# EAGLE design BLDC (EAGLE 9.0.1)
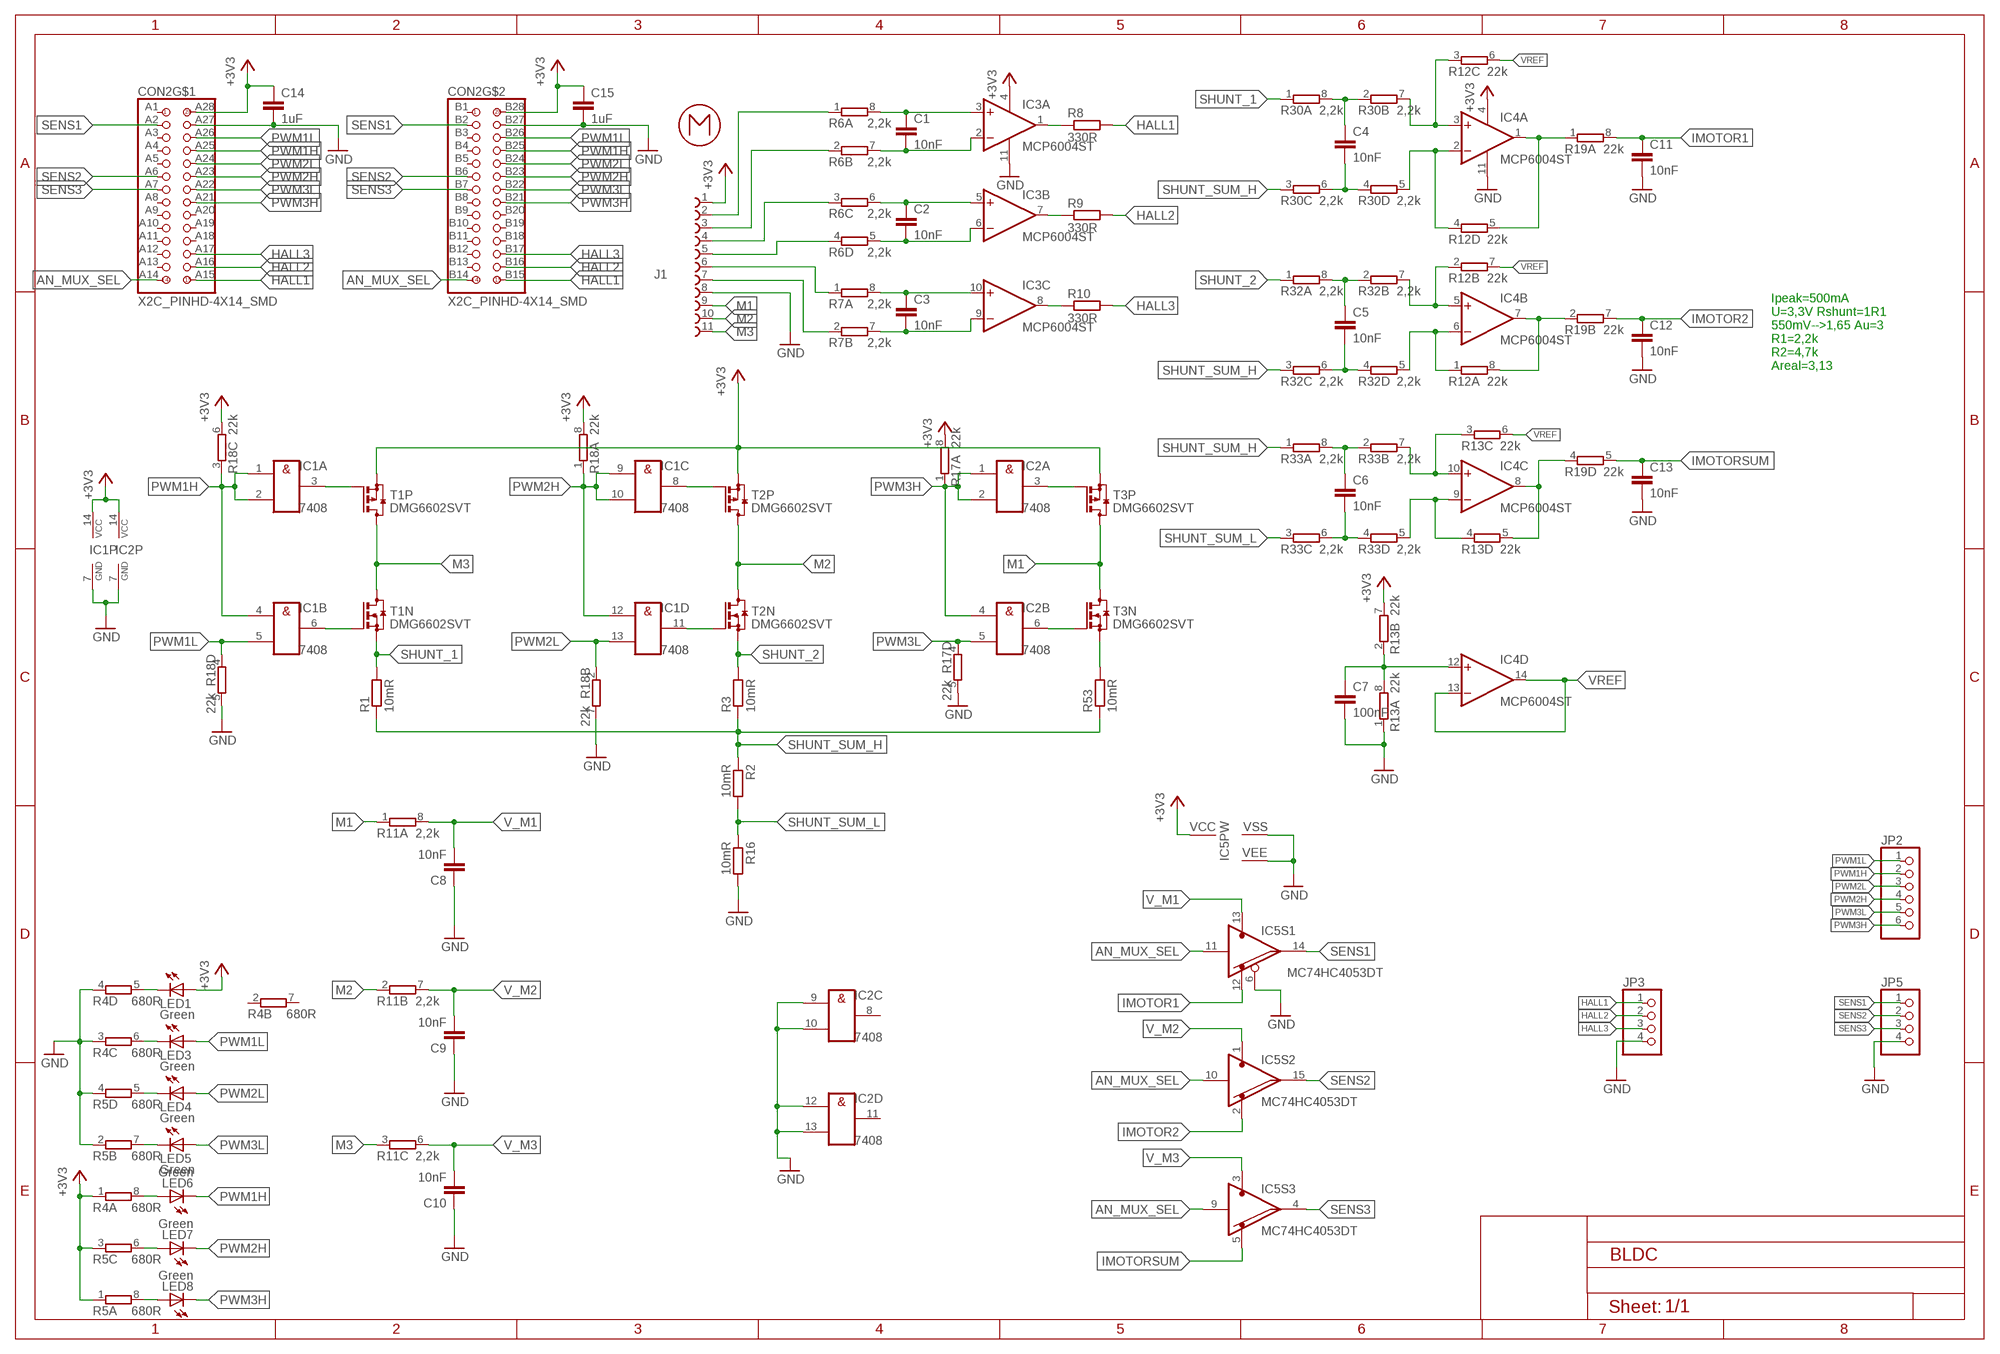
[diagram p0: schematic, sheet 1]

## Parts
C1  10nF  C-EU-SMD_0603_10NF  [C0603K]
C2  10nF  C-EU-SMD_0603_10NF  [C0603K]
C3  10nF  C-EU-SMD_0603_10NF  [C0603K]
C4  10nF  C-EU-SMD_0603_10NF  [C0603K]
C5  10nF  C-EU-SMD_0603_10NF  [C0603K]
C6  10nF  C-EU-SMD_0603_10NF  [C0603K]
C7  100nF  C-EU-SMD_0603_100NF_50V  [C0603K]
C8  10nF  C-EU-SMD_0603_10NF  [C0603K]
C9  10nF  C-EU-SMD_0603_10NF  [C0603K]
C10  10nF  C-EU-SMD_0603_10NF  [C0603K]
C11  10nF  C-EU-SMD_0603_10NF  [C0603K]
C12  10nF  C-EU-SMD_0603_10NF  [C0603K]
C13  10nF  C-EU-SMD_0603_10NF  [C0603K]
C14  1uF  C-EU-SMD_0603_1UF_10V  [C0603K]
C15  1uF  C-EU-SMD_0603_1UF_10V  [C0603K]
CON2  X2C_PINHD-4X14_SMD  [X2C_4X14_SMD]
IC1  7408  [TSSOP14]
IC2  7408  [TSSOP14]
IC3  MCP6004ST  [TSSOP14]
IC4  MCP6004ST  [TSSOP14]
IC5  MC74HC4053DT  [TSSOP16]
J1  68611114122  [68611114122]
JP2  PINHD-1X6  [1X06]
JP3  PINHD-1X4  [1X04]
JP5  PINHD-1X4  [1X04]
LED1  Green  LEDCHIPLED_0805_GREEN  [CHIPLED_0805]
LED3  Green  LEDCHIPLED_0805_GREEN  [CHIPLED_0805]
LED4  Green  LEDCHIPLED_0805_GREEN  [CHIPLED_0805]
LED5  Green  LEDCHIPLED_0805_GREEN  [CHIPLED_0805]
LED6  Green  LEDCHIPLED_0805_GREEN  [CHIPLED_0805]
LED7  Green  LEDCHIPLED_0805_GREEN  [CHIPLED_0805]
LED8  Green  LEDCHIPLED_0805_GREEN  [CHIPLED_0805]
R1  10mR  R-EU_SMDR1206_0,01R  [R1206]
R2  10mR  R-EU_SMDR1206_0,01R  [R1206]
R3  10mR  R-EU_SMDR1206_0,01R  [R1206]
R4  680R  4R-N680R  [EXBV8V_A]
R5  680R  4R-N680R  [EXBV8V_A]
R6  2,2k  4R-N2,2K  [EXBV8V_A]
R7  2,2k  4R-N2,2K  [EXBV8V_A]
R8  330R  R-EU_SMDR0603_330R  [R0603]
R9  330R  R-EU_SMDR0603_330R  [R0603]
R10  330R  R-EU_SMDR0603_330R  [R0603]
R11  2,2k  4R-N2,2K  [EXBV8V_A]
R12  22k  4R-N22K  [EXBV8V_A]
R13  22k  4R-N22K  [EXBV8V_A]
R16  10mR  R-EU_SMDR1206_0,01R  [R1206]
R17  22k  4R-N22K  [EXBV8V_A]
R18  22k  4R-N22K  [EXBV8V_A]
R19  22k  4R-N22K  [EXBV8V_A]
R30  2,2k  4R-N2,2K  [EXBV8V_A]
R32  2,2k  4R-N2,2K  [EXBV8V_A]
R33  2,2k  4R-N2,2K  [EXBV8V_A]
R53  10mR  R-EU_SMDR1206_0,01R  [R1206]
T1  DMG6602SVT  [TSOT23-6]
T2  DMG6602SVT  [TSOT23-6]
T3  DMG6602SVT  [TSOT23-6]
U$2  BLDC_MOTOR  [BLDC_MOTOR]

## Nets
+3V3: C14.1 C15.1 CON2.A28 CON2.B28(A28) IC1.14(P:VCC) IC2.14(P:VCC) IC3.4(P:V+) IC4.4(P:V+) IC5.16(PW:VCC) J1.1 LED1.A R4.1 R5.1 R5.3 R13.7 R17.8 R18.6 R18.8 T1.2(P:S) T2.2(P:S) T3.2(P:S)
AN_MUX_SEL: CON2.A14 CON2.B14(A14) IC5.9(S3:I) IC5.10(S2:I) IC5.11(S1:I)
GND: C7.2 C8.1 C9.1 C10.1 C11.2 C12.2 C13.2 C14.2 C15.2 CON2.A27 CON2.B27(A27) IC1.7(P:GND) IC2.7(P:GND) IC2.9(C:I0) IC2.10(C:I1) IC2.12(D:I0) IC2.13(D:I1) IC3.11(P:V-) IC4.11(P:V-) IC5.6 IC5.7(PW:VEE) IC5.8(PW:GND) J1.8 JP3.4 JP5.4 R4.3 R4.4 R5.2 R5.4 R13.1 R16.2 R17.5 R18.5 R18.7
HALL1: CON2.A15 CON2.B15(A15) JP3.1 R8.2
HALL2: CON2.A16 CON2.B16(A16) JP3.2 R9.2
HALL3: CON2.A17 CON2.B17(A17) JP3.3 R10.2
IMOTOR1: C11.1 IC5.12(S1:O2) R19.8
IMOTOR2: C12.1 IC5.2(S2:O2) R19.7
IMOTORSUM: C13.1 IC5.5(S3:O2) R19.5
M1: J1.9 R11.1 T3.4(P:D) T3.6(N:D)
M2: J1.10 R11.2 T2.4(P:D) T2.6(N:D)
M3: J1.11 R11.3 T1.4(P:D) T1.6(N:D)
N$1: IC1.3(A:O) T1.3(P:G)
N$2: IC1.6(B:O) T1.1(N:G)
N$3: IC1.8(C:O) T2.3(P:G)
N$4: IC1.11(D:O) T2.1(N:G)
N$5: IC2.3(A:O) T3.3(P:G)
N$6: IC2.6(B:O) T3.1(N:G)
N$7: C1.1 IC3.3(A:+IN) R6.8
N$8: C1.2 IC3.2(A:-IN) R6.7
N$9: IC4.8(C:OUT) R13.5 R19.4
N$10: C5.1 R32.2 R32.8
N$11: C4.1 R30.2 R30.8
N$12: C4.2 R30.4 R30.6
N$13: IC4.3(A:+IN) R12.3 R30.7
N$14: IC4.2(A:-IN) R12.4 R30.5
N$15: C5.2 R32.4 R32.6
N$16: IC4.6(B:-IN) R12.1 R32.5
N$17: IC4.5(B:+IN) R12.2 R32.7
N$18: C7.1 IC4.12(D:+IN) R13.2 R13.8
N$19: IC3.8(C:OUT) R10.1
N$20: LED8.A R5.8
N$21: C6.1 R33.2 R33.8
N$22: IC4.10(C:+IN) R13.3 R33.7
N$23: IC4.9(C:-IN) R13.4 R33.5
N$24: C6.2 R33.4 R33.6
N$25: LED7.A R5.6
N$26: LED5.C R5.7
N$27: IC4.7(B:OUT) R12.8 R19.2
N$28: C2.1 IC3.5(B:+IN) R6.6
N$29: LED4.C R5.5
N$30: LED6.A R4.8
N$31: LED3.C R4.6
N$32: LED1.C R4.5
N$33: IC4.1(A:OUT) R12.5 R19.1
N$35: C2.2 IC3.6(B:-IN) R6.5
N$36: C3.2 IC3.9(C:-IN) R7.7
N$39: R53.2 T3.5(N:S)
N$40: C3.1 IC3.10(C:+IN) R7.8
N$41: J1.2 R6.1
N$42: J1.3 R6.2
N$43: J1.4 R6.3
N$44: J1.5 R6.4
N$45: J1.6 R7.1
N$46: J1.7 R7.2
N$47: IC3.1(A:OUT) R8.1
N$48: IC3.7(B:OUT) R9.1
PWM1H: CON2.A25 CON2.B25(A25) IC1.1(A:I0) IC1.2(A:I1) IC1.4(B:I0) JP2.2 LED6.C R18.3
PWM1L: CON2.A26 CON2.B26(A26) IC1.5(B:I1) JP2.1 LED3.A R18.4
PWM2H: CON2.A23 CON2.B23(A23) IC1.9(C:I0) IC1.10(C:I1) IC1.12(D:I0) JP2.4 LED7.C R18.1
PWM2L: CON2.A24 CON2.B24(A24) IC1.13(D:I1) JP2.3 LED4.A R18.2
PWM3H: CON2.A21 CON2.B21(A21) IC2.1(A:I0) IC2.2(A:I1) IC2.4(B:I0) JP2.6 LED8.C R17.1
PWM3L: CON2.A22 CON2.B22(A22) IC2.5(B:I1) JP2.5 LED5.A R17.4
SENS1: CON2.A2 CON2.B2(A2) IC5.14(S1:O) JP5.1
SENS2: CON2.A6 CON2.B6(A6) IC5.15(S2:O) JP5.2
SENS3: CON2.A7 CON2.B7(A7) IC5.4(S3:O) JP5.3
SHUNT_1: R1.2 R30.1 T1.5(N:S)
SHUNT_2: R3.2 R32.1 T2.5(N:S)
SHUNT_SUM_H: R1.1 R2.1 R3.1 R30.3 R32.3 R33.1 R53.1
SHUNT_SUM_L: R2.2 R16.1 R33.3
V_M1: C8.2 IC5.13(S1:O1) R11.8
V_M2: C9.2 IC5.1(S2:O1) R11.7
V_M3: C10.2 IC5.3(S3:O1) R11.6
VREF: IC4.13(D:-IN) IC4.14(D:OUT) R12.6 R12.7 R13.6
Unconnected: CON2.A1 CON2.A3 CON2.A4 CON2.A5 CON2.A8 CON2.A9 CON2.A10 CON2.A11 CON2.A12 CON2.A13 CON2.A18 CON2.A19 CON2.A20 CON2.B1(A1) CON2.B3(A3) CON2.B4(A4) CON2.B5(A5) CON2.B8(A8) CON2.B9(A9) CON2.B10(A10) CON2.B11(A11) CON2.B12(A12) CON2.B13(A13) CON2.B18(A18) CON2.B19(A19) CON2.B20(A20) IC2.8(C:O) IC2.11(D:O) IC3.12(D:+IN) IC3.13(D:-IN) IC3.14(D:OUT) R4.2 R4.7 R7.3 R7.4 R7.5 R7.6 R11.4 R11.5 R17.2 R17.3 R17.6 R17.7 R19.3 R19.6

## Notes on the sheet
- Ipeak=500mA
  U=3,3V Rshunt=1R1
  550mV-->1,65 Au=3
  R1=2,2k
  R2=4,7k
  Areal=3,13

## Library data of the parts
C1-C6 C8-C13 = C_EU_Kando:C-EU-SMD: CAPACITOR, European symbol
C7 = C_EU_Kando:C-EU-SMD: CAPACITOR, European symbol; EAGLEID: 1204
C14 C15 = C_EU_Kando:C-EU-SMD: CAPACITOR, European symbol; EAGLEID: 1309
CON2 = KANDO_KOZOS:X2C_PINHD-4X14_SMD
IC1 IC2 = KANDO_KOZOS:7408: Quad 2-input AND gate
IC3 IC4 = KANDO_KOZOS:MCP6004: Quad Op Amp 2.7V to 6.0V Single Supply Source: http://www.microchip.com/wwwproducts/en/MCP6004
IC5 = MCHP_Egyeb_Kando:MC74HC4053: Triple single-pole, Double-position plus common off Analog multiplexer/demultiplexer
J1 = Wurth_Elektronik_Electromechanic_FPC_Connectors_&_Flat_Flexible_Cable_rev16a:68611114122: WR-FPC 1.00mm SMT ZIF Horizontal Top Contact, 11 Pins=>Code : Con_FPC_ZIF_1.00_68611114122 <http://katalog.we-online.de/media/images/eican/Con_FPC_ZIF_1.00_6861xx14122_pf2.jpg> Details see: http://katalog.we-online.de/en/em/686_1xx_141_22 Created 2014-07-09, Karrer Zheng 2014 (C) Würth Elektronik
JP2 = pinhead:PINHD-1X6: PIN HEADER
JP3 JP5 = KANDO_KOZOS:PINHD-1X4: PIN HEADER
LED1 LED3-LED8 = KANDO_KOZOS:LED: LED OSRAM: - CHIPLED LG R971, LG N971, LY N971, LG Q971, LY Q971, LO R971, LY R971 LH N974, LH R974 LS Q976, LO Q976, LY Q976 LO Q996 - Hyper CHIPLED LW Q18S LB Q993, LB Q99A, LB R99A - SideLED LS A670, LO A670, LY A670, LG A670, LP A670 LB A673, LV A673, LT A673, LW A673 LH A674 LY A675 LS A676, LA A676, LO A676, LY A676, LW A676 LS A679, LY A679, LG A679 - Hyper Micro SIDELED® LS Y876, LA Y876, LO Y876, LY Y876 LT Y87S - SmartLED LW L88C, LW L88S LB L89C, LB L89S, LG L890 LS L89K, LO L89K, LY L89K LS L896, LA L896, LO L896, LY L896 - TOPLED LS T670, LO T670, LY T670, LG T670, LP T670 LSG T670, LSP T670, LSY T670, LOP T670, LYG T670 LG T671, LOG T671, LSG T671 LB T673, LV T673, LT T673, LW T673 LH T674 LS T676, LA T676, LO T676, LY T676, LB T676, LH T676, LSB T676, LW T676 LB T67C, LV T67C, LT T67C, LS T67K, LO T67K, LY T67K, LW E67C LS E67B, LA E67B, LO E67B, LY E67B, LB E67C, LV E67C, LT E67C LW T67C LS T679, LY T679, LG T679 LS T770, LO T770, LY T770, LG T770, LP T770 LB T773, LV T773, LT T773, LW T773 LH T774 LS E675, LA E675, LY E675, LS T675 LS T776, LA T776, LO T776, LY T776, LB T776 LHGB T686 LT T68C, LB T68C - Hyper Mini TOPLED® LB M676 - Mini TOPLED Santana® LG M470 LS M47K, LO M47K, LY M47K Source: http://www.osram.convergy.de LUXEON: - LUMILED® LXK2-PW12-R00, LXK2-PW12-S00, LXK2-PW14-U00, LXK2-PW14-V00 LXK2-PM12-R00, LXK2-PM12-S00, LXK2-PM14-U00 LXK2-PE12-Q00, LXK2-PE12-R00, LXK2-PE12-S00, LXK2-PE14-T00, LXK2-PE14-U00 LXK2-PB12-K00, LXK2-PB12-L00, LXK2-PB12-M00, LXK2-PB14-N00, LXK2-PB14-P00, LXK2-PB14-Q00 LXK2-PR12-L00, LXK2-PR12-M00, LXK2-PR14-Q00, LXK2-PR14-R00 LXK2-PD12-Q00, LXK2-PD12-R00, LXK2-PD12-S00 LXK2-PH12-R00, LXK2-PH12-S00 LXK2-PL12-P00, LXK2-PL12-Q00, LXK2-PL12-R00 Source: www.luxeon.com KINGBRIGHT: KA-3528ASYC Source: www.kingbright.com; EAGLEID: 1109
R1-R3 R16 R53 = R_EU:R-EU_SMD: RESISTOR, European symbol
R4 R5 = KANDO_KOZOS:4R-N: Array Chip Resistor; EAGLEID: 1028
R6 R7 R11 R30 R32 R33 = KANDO_KOZOS:4R-N: Array Chip Resistor; EAGLEID: 1022
R8-R10 = R_EU:R-EU_SMD: RESISTOR, European symbol; EAGLEID: 1374
R12 R13 R17-R19 = R_EU:4R-N: Array Chip Resistor
T1-T3 = KANDO_KOZOS:DMG6602SVT; EAGLEID: 1334
U$2 = Gyore:BLDC_MOTOR

## Board
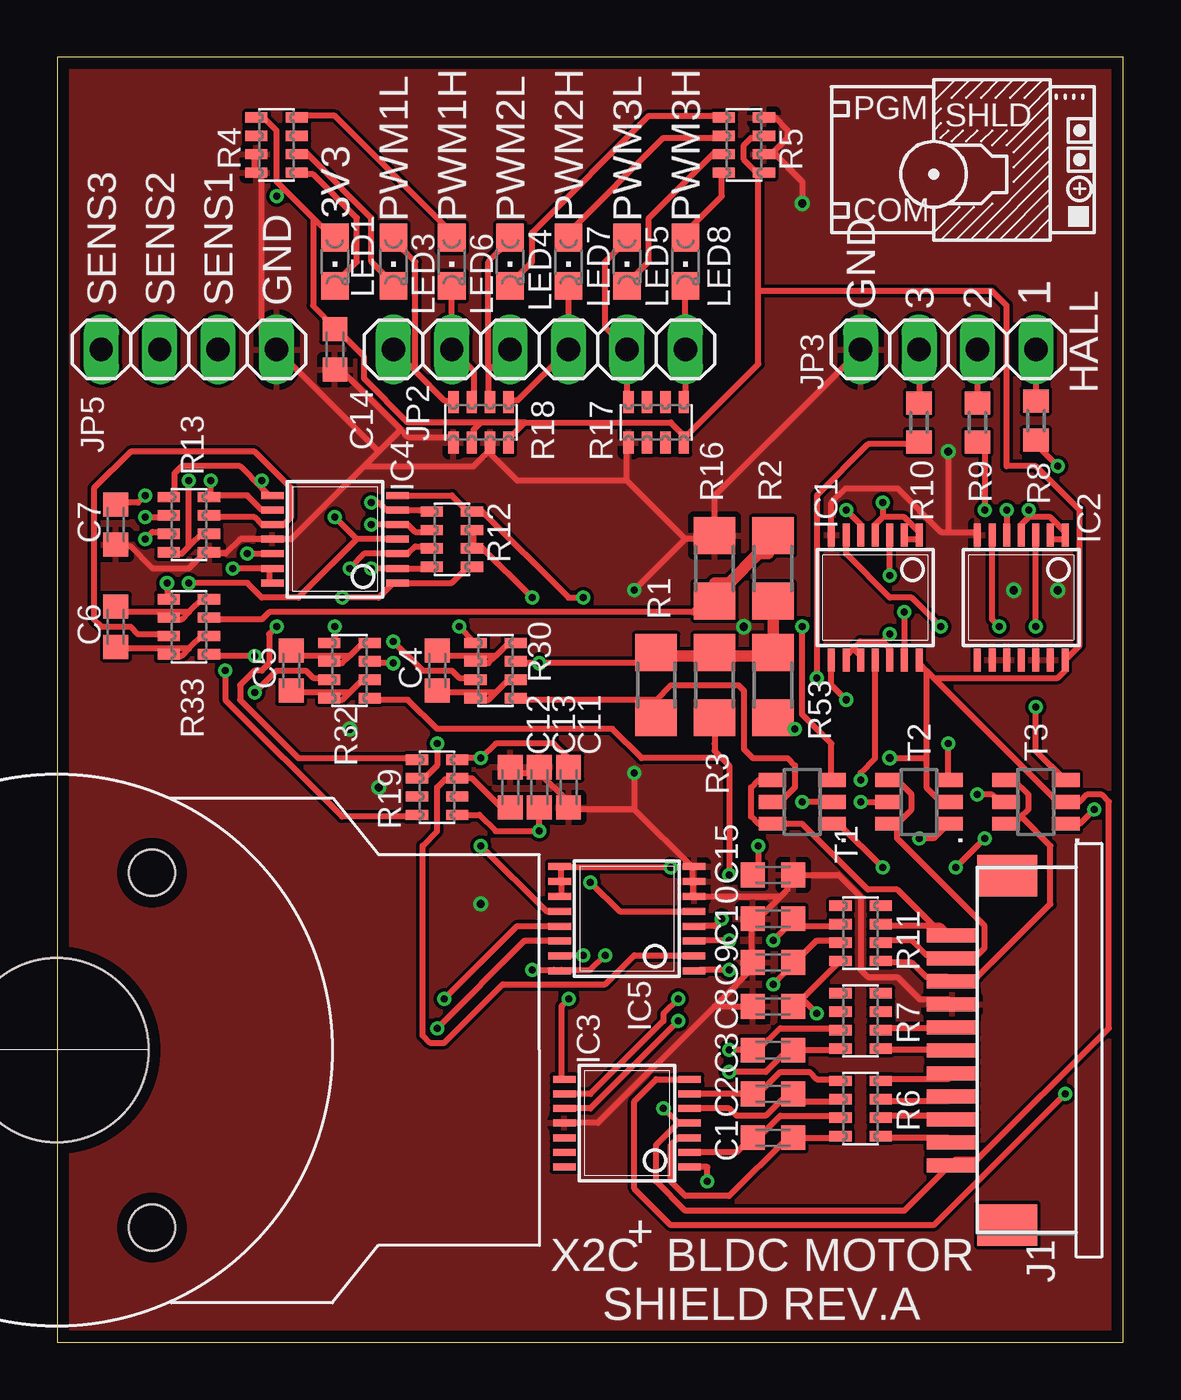
[diagram p1: board, top side]
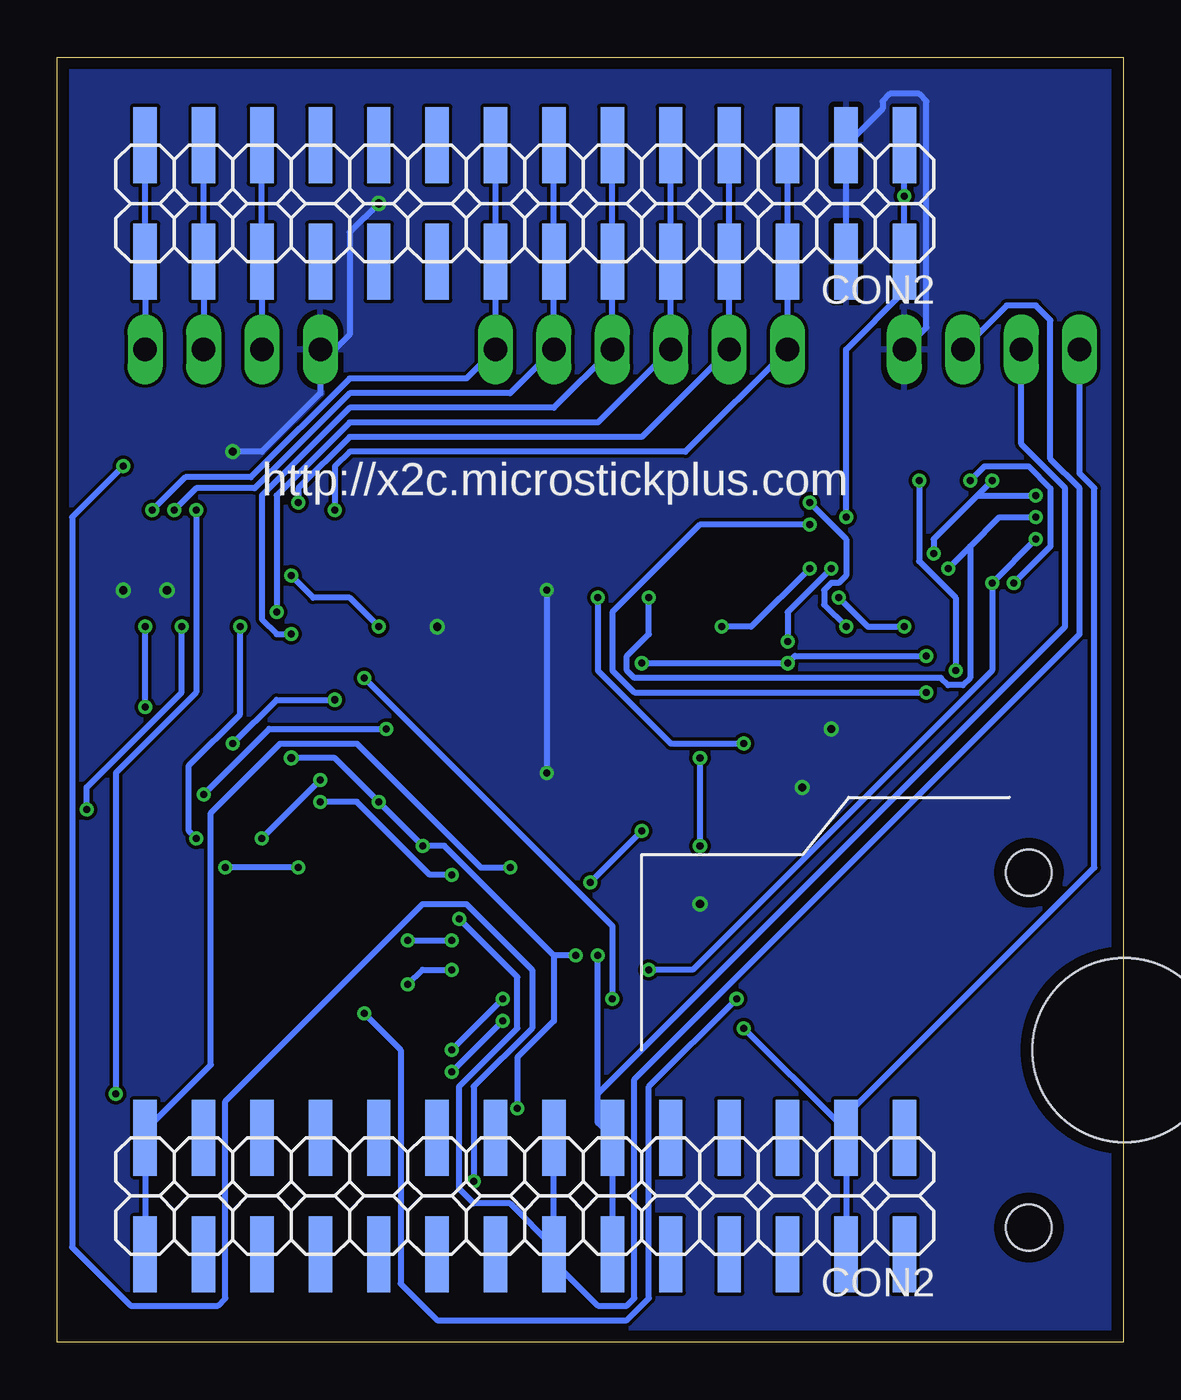
[diagram p2: board, bottom side, seen from below]

Size 46.35 x 55.88 mm. Coordinates in mm from the lower left corner, seen from the top.
Outline: 46.35,55.88 0,55.88 0,0 46.35,0 46.35,55.88
Copper layers (1*16): Top 0.035mm / dielectric 1.6mm / Bottom 0.035mm
Design rules "Elecrow_2-layer_PCB_eagle_rule *": minimum track width 10mil, minimum drill 12mil, track to track 6mil, track to pad 6mil, pad to pad 6mil, via to via 8mil, smd to smd 0mil, copper to edge 20mil, drill to drill 10mil, minimum pad ring 6mil, minimum via ring 6mil, stop-mask expansion 0mil, vias tented up to drill 100mil, thermal gap 10mil

### Footprints (pad centres in the part's own frame; a part is rotated, then mirrored left to right if it is on the bottom)
C0603K = smd 1.05 x 1.08: 1 -0.875,0; 2 0.875,0
X2C_4X14_SMD = smd 1.016 x 3.302: A1 -16.51,44.45; A2 -13.97,44.45; A3 -11.43,44.45; A4 -8.89,44.45; A5 -6.35,44.45; A6 -3.81,44.45; A7 -1.27,44.45; A8 1.27,44.45; A9 3.81,44.45; A10 6.35,44.45; A11 8.89,44.45; A12 11.43,44.45; A13 13.97,44.45; A14 16.51,44.45; A15 16.51,1.27; A16 13.97,1.27; A17 11.43,1.27; A18 8.89,1.27; A19 6.35,1.27; A20 3.81,1.27; A21 1.27,1.27; A22 -1.27,1.27; A23 -3.81,1.27; A24 -6.35,1.27; A25 -8.89,1.27; A26 -11.43,1.27; A27 -13.97,1.27; A28 -16.51,1.27; B1 -16.51,39.37; B2 -13.97,39.37; B3 -11.43,39.37; B4 -8.89,39.37; B5 -6.35,39.37; B6 -3.81,39.37; B7 -1.27,39.37; B8 1.27,39.37; B9 3.81,39.37; B10 6.35,39.37; B11 8.89,39.37; B12 11.43,39.37; B13 13.97,39.37; B14 16.51,39.37; B15 16.51,-3.81; B16 13.97,-3.81; B17 11.43,-3.81; B18 8.89,-3.81; B19 6.35,-3.81; B20 3.81,-3.81; B21 1.27,-3.81; B22 -1.27,-3.81; B23 -3.81,-3.81; B24 -6.35,-3.81; B25 -8.89,-3.81; B26 -11.43,-3.81; B27 -13.97,-3.81; B28 -16.51,-3.81
TSSOP14 = smd 0.305 x 0.991: 1 -1.905,-2.718; 2 -1.27,-2.718; 3 -0.635,-2.718; 4 0,-2.718; 5 0.635,-2.718; 6 1.27,-2.718; 7 1.905,-2.718; 8 1.905,2.718; 9 1.27,2.718; 10 0.635,2.718; 11 0,2.718; 12 -0.635,2.718; 13 -1.27,2.718; 14 -1.905,2.718
TSSOP16 = smd 0.305 x 0.991: 1 -2.275,-2.918; 2 -1.625,-2.918; 3 -0.975,-2.918; 4 -0.325,-2.918; 5 0.325,-2.918; 6 0.975,-2.918; 7 1.625,-2.918; 8 2.275,-2.918; 9 2.275,2.918; 10 1.625,2.918; 11 0.975,2.918; 12 0.325,2.918; 13 -0.325,2.918; 14 -0.975,2.918; 15 -1.625,2.918; 16 -2.275,2.918
68611114122 = smd 0.6 x 2.2: 1 -8.5,1.1; 2 -7.5,1.1; 3 -6.5,1.1; 4 -5.5,1.1; 5 -4.5,1.1; 6 -3.5,1.1; 7 -2.5,1.1; 8 -1.5,1.1; 9 -0.5,1.1; 10 0.5,1.1; 11 1.5,1.1 | smd 1.8 x 2.6: Z1 -11.1,-1.3; Z2 4.1,-1.3
1X06 = drill 1.016 long: 1 -6.35,0; 2 -3.81,0; 3 -1.27,0; 4 1.27,0; 5 3.81,0; 6 6.35,0
1X04 = drill 1.016 long: 1 -3.81,0; 2 -1.27,0; 3 1.27,0; 4 3.81,0
CHIPLED_0805 = smd 1.2 x 1.2: A 0,-1.05; C 0,1.05
R1206 = smd 1.6 x 1.803: 1 -1.422,0; 2 1.422,0
EXBV8V_A = smd 0.45 x 0.965: 1 -1.2,-0.876; 2 -0.4,-0.876; 3 0.4,-0.876; 4 1.2,-0.876; 5 1.2,0.876; 6 0.4,0.876; 7 -0.4,0.876; 8 -1.2,0.876
R0603 = smd 1 x 1.1: 1 -0.85,0; 2 0.85,0
TSOT23-6 = smd 0.6 x 1.2: 1 -0.95,-1.3; 2 0,-1.3; 3 0.95,-1.3; 4 0.95,1.3; 5 0,1.3; 6 -0.95,1.3
BLDC_MOTOR = hole 8: 0,-21 | hole 2: 0,-30.24; 7.72,-16.84; -7.72,-16.84

### Placement (x,y rotation side)
C1  31.11,8.89 180 top
C2  31.11,10.79 180 top
C3  31.11,12.7 180 top
C4  16.51,29.21 90 top
C5  10.16,29.21 90 top
C6  2.54,31.11 90 top
C7  2.54,35.56 270 top
C8  31.11,14.61 0 top
C9  31.11,16.51 0 top
C10  31.11,18.41 0 top
C11  22.23,24.13 270 top
C12  19.68,24.13 90 top
C13  20.95,24.13 90 top
C14  12.07,43.18 270 top
C15  31.11,20.32 0 top
CON2  26.04,48.26 180 bottom
IC1  35.56,32.38 180 top
IC2  41.91,32.38 180 top
IC3  24.77,9.53 90 top
IC4  12.06,34.92 90 top
IC5  24.77,18.41 90 top
J1  40.01,16.19 90 top
JP2  20.95,43.18 0 top
JP3  38.73,43.18 180 top
JP5  5.71,43.18 0 top
LED1  12.06,46.99 180 top
LED3  14.61,46.99 180 top
LED4  19.68,46.99 180 top
LED5  24.77,46.99 180 top
LED6  17.14,46.99 180 top
LED7  22.23,46.99 180 top
LED8  27.3,46.99 180 top
R1  26.04,28.57 270 top
R2  31.11,33.66 90 top
R3  28.57,28.57 270 top
R4  9.53,52.07 270 top
R5  29.84,52.07 90 top
R6  34.92,10.16 90 top
R7  34.92,13.97 90 top
R8  42.55,40.08 90 top
R9  40.01,40.01 90 top
R10  37.47,40.01 90 top
R11  34.92,17.78 90 top
R12  17.14,34.92 270 top
R13  5.71,35.56 90 top
R16  28.57,33.66 90 top
R17  26.04,40.01 180 top
R18  18.41,40.01 180 top
R19  16.51,24.13 270 top
R30  19.05,29.21 90 top
R32  12.7,29.21 90 top
R33  5.71,31.11 90 top
R53  31.11,28.57 270 top
T1  32.38,23.5 90 top
T2  37.47,23.5 90 top
T3  42.55,23.5 90 top
U$2  20.95,12.7 270 top

### Tracks (layer width: path | path; a pad name or v marks a point on that pad's centre or on a via)
+3V3  (via drill 0.3, 0.35)
  Top 0.254: 38.1,28.89 43.5,28.89 43.81,29.21 IC2.14 44.45,30.3 44.45,36.2 42.55,38.1 41.27,38.1 41.27,45.09 40.64,45.72 30.48,45.72 | 37.78,29.21 37.47,29.53 IC1.14 | 37.78,29.21 38.1,28.89 | 38.1,28.89 43.5,23.5 T3.2 44.45,23.5 44.77,23.81 45.4,23.81 45.72,23.5 45.72,13.65 40.01,7.94 39.05,7.94 J1.1 38.73,7.62 36.83,5.71 27.3,5.71 26.04,6.99 26.04,8.57 26.99,9.53 | T2.2 38.42,23.5 37.78,24.13 37.78,25.4 | 37.78,29.21 37.78,25.4 | 26.99,9.53 IC3.4 | 11.11,48.9 12.06,47.94 LED1.A | 11.11,48.9 9.84,50.16 | 9.84,50.16 9.53,50.48 9.53,52.7 8.89,53.34 R4.1 | 11.11,48.9 11.11,45.09 12.06,44.13 C14.1 12.38,43.81 13.34,42.86 13.34,41.91 15.24,40.01 18.41,40.01 | 9.84,50.16 v9.53,49.85 | 30.48,50.8 29.84,51.44 29.84,52.07 30.16,52.39 30.48,52.39 R5.3 | 27.3,39.37 26.67,40.01 20.32,40.01 | 20.32,40.01 19.68,39.37 R18.8 | 18.41,40.01 18.1,39.69 18.1,39.37 R18.6 | 20.32,40.01 18.41,40.01 | 30.48,45.72 30.48,42.55 27.3,39.37 | 30.48,45.72 30.48,50.8 | 30.48,50.8 R5.1 | 27.3,39.37 R17.8 | v30.48,21.59 30.48,20.64 C15.1 | T1.2 v32.38,23.5 | v3.81,34.92 4.13,35.24 4.76,35.24 R13.7 | v5.71,33.02 8.26,33.02 8.89,32.38 10.48,32.38 13.02,34.92 | IC4.4 13.02,34.92 | v20.64,16.19 21.59,16.19 IC5.16 21.91,16.19 23.18,16.19 v23.81,16.83 | 13.02,34.92 v12.06,35.88 | v26.35,10.16 26.99,9.53 | v36.2,25.4 37.78,25.4
  Bottom 0.254: CON2.B28 v9.53,49.85 CON2.A28 9.53,45.72 12.06,43.18 v12.06,35.88 | v3.81,34.92 v5.71,33.02 5.71,29.21 18.73,16.19 v20.64,16.19 | 24.77,16.83 29.53,21.59 v30.48,21.59 v32.38,23.5 34.29,25.4 v36.2,25.4 | v23.81,16.83 24.77,16.83 | v26.35,10.16 26.35,12.38 24.77,13.97 24.77,16.83
AN_MUX_SEL  (via drill 0.3)
  Top 0.254: 21.91,20 21.91,20.64 | 21.91,20 21.91,19.37 IC5.11 | 21.91,20 IC5.10 | v26.67,20.64 21.91,20.64 | 21.91,20.64 IC5.9
  Bottom 0.254: v26.67,20.64 27.94,20.64 33.34,26.04 36.67,26.04 39.69,23.02 39.69,12.06 42.55,9.21 CON2.B14 CON2.A14
GND  (via drill 0.3, 0.35)
  Top 0.254: IC3.11 23.5,9.53 28.57,14.61 | 28.57,14.61 30.48,16.51 C9.1 30.16,16.51 30.16,18.41 C10.1 30.48,18.41 31.43,19.37 | 28.57,14.61 C8.1 | 20.95,24.77 19.68,24.77 C12.2 | 20.95,24.77 22.23,23.5 C11.2 22.23,23.18 25.08,23.18 | 20.95,24.77 C13.2 | 27.62,20 27.62,20.64 | 27.62,20 27.62,19.37 IC5.6 27.94,19.37 31.43,19.37 | 27.62,20 IC5.7 | 31.43,19.37 31.75,19.68 31.75,20.32 C15.2 32.07,20.32 33.97,20.32 34.92,19.37 34.92,16.19 35.24,15.88 36.51,15.88 37.47,14.92 38.73,14.92 J1.8 | 27.62,20.64 25.08,23.18 | 27.62,20.64 IC5.8 | 38.73,35.24 38.42,35.24 36.51,37.15 34.29,37.15 33.66,36.51 IC1.7 | 38.73,35.24 40.01,35.24 IC2.7 | 31.11,51.75 31.75,52.39 31.75,52.7 31.11,53.34 30.8,53.34 R5.4 | 31.11,51.75 30.8,51.75 R5.2 31.11,51.75 | 31.11,51.75 32.38,50.48 v32.38,49.53 | R4.3 8.57,51.75 8.57,50.8 R4.4 8.89,50.8 8.89,43.81 JP5.4 13.97,38.73 | 24.77,37.47 24.77,39.05 R17.5 | 27.3,34.92 28.57,34.92 R16.2 28.57,36.83 JP3.4 | 27.3,34.92 24.77,37.47 | 18.73,38.73 18.73,39.05 R18.7 18.73,38.73 | 18.73,38.73 20,37.47 24.77,37.47 | C7.2 2.54,34.61 3.17,34.61 4.13,33.66 5.71,33.66 6.35,34.29 R13.1 6.67,34.29 7.3,34.29 7.94,34.92 IC4.11 10.16,34.92 13.34,38.1 | 14.92,39.69 12.38,42.23 C14.2 | 14.92,39.69 15.24,39.37 17.14,39.37 R18.5 | 14.92,39.69 13.97,38.73 | 13.97,38.73 13.34,38.1 | 18.73,38.73 18.1,38.1 13.34,38.1 | v25.08,24.77 25.08,23.18 | 27.3,34.92 v25.08,32.7 | v38.73,38.73 38.73,35.24
  Bottom 0.254: CON2.A27 CON2.B27 10.48,53.66 10.48,53.98 10.16,54.29 8.89,54.29 8.57,53.98 8.57,44.13 JP5.4 | v25.08,32.7 v25.08,24.77 | v38.73,38.73 37.47,38.73 34.92,41.27 JP3.4 34.29,43.18 33.66,43.81 33.66,48.27 33.01,48.92 32.99,48.92 v32.38,49.53
  other vias: 18.41,19.05 13.97,24.13 12.7,26.67 29.84,31.11 41.59,32.7 43.5,32.7
  pour Top: 46.35,0 0,0 arc-180 0,25.4 0,55.88 46.35,55.88
  pour Bottom: 46.35,0 0,0 arc-180 0,25.4 0,55.88 46.35,55.88
HALL1
  Top 0.254: JP3.1 R8.2
  Bottom 0.254: CON2.B15 CON2.A15 JP3.1
HALL2
  Top 0.254: JP3.2 R9.2
  Bottom 0.254: CON2.B16 CON2.A16 JP3.2
HALL3
  Top 0.254: JP3.3 R10.2
  Bottom 0.254: CON2.B17 CON2.A17 JP3.3
IMOTOR1  (via drill 0.3)
  Top 0.254: C11.1 22.23,25.4 21.59,26.04 19.05,26.04 v18.41,25.4 17.46,25.4 R19.8 | v18.41,21.59 21.27,18.73 21.59,18.73 IC5.12
  Bottom 0.254: v18.41,25.4 v18.41,21.59
IMOTOR2
  Top 0.254: 19.45,23.5 C12.1 19.29,23.25 18.02,24.53 R19.7 17.24,24.48 | IC5.2 27.62,16.83 25.08,16.83 23.81,15.56 19.37,15.56 16.83,13.02 16.19,13.02 15.88,13.34 15.88,21.59 16.51,22.23 16.51,24.13 16.86,24.48 17.24,24.48 | 17.14,24.45 17.24,24.48
IMOTORSUM  (via drill 0.3)
  Top 0.254: 20.95,22.86 C13.1 v20.95,22.23 19.05,22.23 18.34,22.93 R19.5 17.46,22.86 | v23.18,20 24.45,18.73 27.62,18.73 IC5.5
  Bottom 0.254: v20.95,22.23 v23.18,20
M1
  Top 0.254: 41.91,22.86 41.59,22.54 41.27,22.54 T3.6 | 41.91,22.86 42.23,23.18 42.23,23.81 41.59,24.45 41.27,24.45 T3.4 | R11.1 35.88,16.51 37.15,16.51 37.78,15.88 38.73,15.88 J1.9 39.05,15.88 40.01,15.88 43.18,19.05 43.18,21.59 41.91,22.86
M2
  Top 0.254: 36.51,22.54 37.15,23.18 37.15,23.81 36.51,24.45 36.2,24.45 T2.4 | 36.51,22.54 36.2,22.54 T2.6 36.51,22.54 | R11.2 35.88,17.46 37.15,17.46 37.78,16.83 38.73,16.83 J1.10 39.05,16.83 40.01,16.83 40.32,17.14 40.32,18.1 36.51,21.91 36.51,22.54
M3
  Top 0.254: T1.4 30.8,24.45 30.48,24.45 30.16,24.13 30.16,22.86 30.48,22.54 30.8,22.54 T1.6 31.11,22.54 32.38,22.54 35.24,19.68 36.51,19.68 38.1,18.1 | 38.1,18.1 38.42,18.1 38.73,17.78 J1.11 | 38.1,18.1 35.88,18.1 R11.3
N$1  (via drill 0.3)
  Top 0.254: v36.2,33.34 IC1.3 | v32.38,31.11 32.38,27.3 33.66,26.04 33.66,24.45 T1.3
  Bottom 0.254: v32.38,31.11 33.66,32.38 35.24,32.38 v36.2,33.34
N$2  (via drill 0.3)
  Top 0.254: IC1.6 34.29,34.29 36.2,32.38 37.15,32.38 v38.42,31.11 | v39.05,20.64 v40.32,21.91 | v35.88,20.64 33.97,22.54 T1.1
  Bottom 0.254: v38.42,31.11 38.42,27.3 40.64,25.08 40.64,22.23 v40.32,21.91 | v35.88,20.64 v39.05,20.64
N$3  (via drill 0.3)
  Top 0.254: IC1.8 33.66,28.57 v34.29,27.94 | v38.73,26.04 38.73,24.45 T2.3
  Bottom 0.254: v34.29,27.94 36.83,27.94 v38.73,26.04
N$4  (via drill 0.3)
  Top 0.254: IC1.11 35.56,25.4 34.92,24.77 v34.92,24.45 | v37.47,21.91 38.1,21.91 38.73,22.54 T2.1
  Bottom 0.254: v37.47,21.91 v34.92,24.45
N$5  (via drill 0.3)
  Top 0.254: v42.55,31.11 IC2.3 | v42.55,27.62 42.55,25.72 43.81,24.45 T3.3
  Bottom 0.254: v42.55,27.62 v42.55,31.11
N$6  (via drill 0.3)
  Top 0.254: IC2.6 40.64,31.43 v40.96,31.11 | v45.09,23.18 44.45,22.54 44.13,22.54 T3.1
  Bottom 0.254: v40.96,31.11 40.96,28.26 45.09,24.13 v45.09,23.18
N$7
  Top 0.254: R6.8 33.97,8.89 C1.1 31.75,8.89 29.21,6.35 27.3,6.35 26.67,6.99 26.67,8.57 26.99,8.89 IC3.3
N$8
  Top 0.254: R6.7 33.97,9.84 31.43,9.84 30.48,8.89 C1.2 30.16,8.89 29.53,8.26 IC3.2
N$9  (via drill 0.3)
  Top 0.254: 8.89,37.15 9.21,36.83 IC4.8 | 8.89,37.15 7.94,38.1 5.4,38.1 5.08,37.78 5.08,36.83 R13.5 | v7.3,29.21 7.3,27.94 12.38,22.86 15.56,22.86 R19.4 15.56,22.86 | 8.89,37.15 v8.89,37.47
  Bottom 0.254: v7.3,29.21 7.3,32.38 8.89,33.97 v8.89,37.47
N$10
  Top 0.254: 12.7,28.26 12.38,27.94 12.06,27.94 R32.8 | 12.7,28.26 13.34,28.89 R32.2 | 12.7,28.26 10.16,28.26 C5.1
N$11
  Top 0.254: 19.05,28.26 18.73,27.94 18.41,27.94 R30.8 | 19.05,28.26 19.68,28.89 R30.2 | 19.05,28.26 16.51,28.26 C4.1
N$12
  Top 0.254: 19.05,29.84 18.73,29.53 18.41,29.53 R30.6 | 19.05,29.84 19.68,30.48 R30.4 | 19.05,29.84 16.51,29.84 C4.2
N$13  (via drill 0.3)
  Top 0.254: R12.3 16.19,34.61 15.56,34.61 15.24,34.29 IC4.3 13.34,34.29 v12.7,33.66 | v14.61,30.48 15.88,29.21 17.14,29.21 17.46,28.89 18.1,28.89 R30.7
  Bottom 0.254: v14.61,30.48 14.61,31.75 v12.7,33.66
N$14  (via drill 0.3)
  Top 0.254: R12.4 16.19,33.66 IC4.2 v13.65,33.66 | v17.46,31.11 18.1,30.48 R30.5
  Bottom 0.254: v17.46,31.11 16.19,31.11 v13.65,33.66
N$15
  Top 0.254: 12.7,29.84 12.38,29.53 12.06,29.53 R32.6 | 12.7,29.84 13.34,30.48 R32.4 | 12.7,29.84 10.16,29.84 C5.2
N$16  (via drill 0.3)
  Top 0.254: R12.1 16.19,36.2 IC4.6 14.29,36.2 13.97,36.51 v13.65,36.51 | v12.06,31.11 12.06,30.48 R32.5
  Bottom 0.254: v12.06,31.11 13.02,32.07 13.02,32.7 12.7,33.02 12.38,33.02 12.06,33.34 12.06,34.92 v13.65,36.51
N$17  (via drill 0.3)
  Top 0.254: R12.2 16.19,35.24 15.56,35.24 15.24,35.56 IC4.5 v13.65,35.56 | v8.57,28.26 9.53,29.21 10.79,29.21 11.11,28.89 11.75,28.89 R32.7
  Bottom 0.254: v8.57,28.26 21.27,28.26 22.23,29.21 22.23,31.75 18.41,35.56 v13.65,35.56
N$18  (via drill 0.3)
  Top 0.254: 5.71,34.61 5.4,34.29 5.08,34.29 R13.8 | 5.71,34.61 6.35,35.24 R13.2 | v8.26,34.29 IC4.12 | 5.71,34.61 v5.71,37.47 | v3.81,36.83 3.49,36.51 2.54,36.51 C7.1
  Bottom 0.254: v8.26,34.29 8.26,34.92 6.35,36.83 | v5.71,37.47 6.35,36.83 | 6.35,36.83 v3.81,36.83
N$19  (via drill 0.3)
  Top 0.254: v22.23,14.92 21.91,14.61 21.91,11.43 IC3.8 | v33.02,28.89 33.02,36.83 35.24,39.05 37.47,39.05 R10.1
  Bottom 0.254: v22.23,14.92 22.23,18.1 v33.02,28.89
N$20
  Top 0.254: R5.8 28.89,50.8 28.89,49.85 27.3,48.26 LED8.A
N$21
  Top 0.254: 5.71,30.16 5.4,29.84 5.08,29.84 R33.8 | 5.71,30.16 6.35,30.8 R33.2 | 5.71,30.16 2.54,30.16 C6.1
N$22
  Top 0.254: R13.3 6.67,35.88 8.57,35.88 8.89,35.56 IC4.10 9.84,35.56 10.16,35.88 10.16,37.15 8.57,38.73 3.17,38.73 1.59,37.15 1.59,31.43 1.91,31.11 3.17,31.11 3.49,30.8 4.76,30.8 R33.7
N$23  (via drill 0.3)
  Top 0.254: 6.67,36.83 8.26,36.83 8.89,36.2 IC4.9 | v4.76,33.02 4.76,32.38 R33.5 | 6.67,36.83 v6.67,37.47 | 6.67,36.83 R13.4
  Bottom 0.254: v4.76,33.02 3.17,34.61 3.17,37.15 4.13,38.1 6.03,38.1 v6.67,37.47
N$24
  Top 0.254: 5.71,31.75 5.4,31.43 5.08,31.43 R33.6 | 5.71,31.75 6.35,32.38 R33.4 | 5.71,31.75 2.54,31.75 C6.2
N$25
  Top 0.254: R5.6 28.89,52.39 26.35,52.39 22.23,48.26 LED7.A
N$26
  Top 0.254: R5.7 28.89,51.75 28.57,51.75 25.72,48.9 25.72,46.99 24.77,46.04 LED5.C
N$27  (via drill 0.3)
  Top 0.254: IC4.7 17.14,36.83 17.78,36.2 R12.8 18.1,36.2 18.41,36.2 22.23,32.38 v22.86,32.38 | v16.51,26.04 16.51,25.08 15.88,24.45 R19.2
  Bottom 0.254: v16.51,26.04 19.68,26.04 22.86,29.21 v22.86,32.38
N$28
  Top 0.254: R6.6 33.97,10.48 32.38,10.48 32.07,10.79 C2.1 31.75,10.79 30.8,9.84 29.53,9.84 29.21,10.16 IC3.5
N$29
  Top 0.254: R5.5 28.89,53.34 25.72,53.34 20.64,48.26 20.64,46.99 19.68,46.04 LED4.C
N$30
  Top 0.254: R4.8 10.48,53.34 12.06,53.34 17.14,48.26 LED6.A
N$31
  Top 0.254: R4.6 10.48,51.75 10.79,51.75 13.65,48.9 13.65,46.99 14.61,46.04 LED3.C
N$32
  Top 0.254: R4.5 10.48,50.8 11.11,50.8 13.02,48.9 13.02,46.99 12.06,46.04 LED1.C
N$33  (via drill 0.3)
  Top 0.254: R12.5 17.78,33.66 17.14,33.02 IC4.1 14.61,33.02 13.97,32.38 v12.38,32.38 | v9.53,31.11 9.21,30.8 9.21,29.53 8.89,29.21 8.57,29.21 7.94,28.57 7.94,27.94 10.48,25.4 15.56,25.4 R19.1
  Bottom 0.254: v9.53,31.11 11.11,31.11 v12.38,32.38
N$35
  Top 0.254: R6.5 33.97,11.43 33.02,11.43 32.7,11.75 31.43,11.75 30.48,10.79 C2.2 IC3.6
N$36  (via drill 0.3)
  Top 0.254: R7.7 33.97,13.65 31.43,13.65 30.48,12.7 C3.2 v29.21,12.7 | IC3.9 23.18,10.79 26.35,13.97 26.35,14.29 v26.99,14.92
  Bottom 0.254: v29.21,12.7 v26.99,14.92
N$39  (via drill 0.3)
  Top 0.254: v32.07,26.67 31.11,27.62 R53.2 | v40.01,23.81 40.64,23.81 40.96,23.5 T3.5
  Bottom 0.254: v32.07,26.67 37.15,26.67 v40.01,23.81
N$40  (via drill 0.3)
  Top 0.254: R7.8 33.97,12.7 C3.1 31.75,12.7 30.8,11.75 v29.21,11.75 | IC3.10 23.18,10.16 v26.99,13.97
  Bottom 0.254: v29.21,11.75 v26.99,13.97
N$41
  Top 0.254: R6.1 35.88,8.89 38.73,8.89 J1.2
N$42
  Top 0.254: R6.2 35.88,9.84 38.73,9.84 J1.3
N$43
  Top 0.254: R6.3 35.88,10.48 38.73,10.48 J1.4
N$44
  Top 0.254: R6.4 35.88,11.43 38.73,11.43 J1.5
N$45
  Top 0.254: R7.1 35.88,12.7 38.73,12.7 J1.6
N$46
  Top 0.254: R7.2 35.88,13.65 38.73,13.65 J1.7
N$47  (via drill 0.3)
  Top 0.254: v28.26,6.99 28.26,7.62 IC3.1 | v43.5,38.1 42.55,39.05 R8.1
  Bottom 0.254: v28.26,6.99 28.26,11.11 25.72,13.65 25.72,16.19 28.57,19.05 30.48,19.05 39.05,10.48 39.05,1.91 39.37,1.59 43.18,1.59 45.72,4.13 45.72,35.88 v43.5,38.1
N$48  (via drill 0.3)
  Top 0.254: IC3.7 26.04,11.43 25.08,10.48 25.08,6.67 26.67,5.08 38.1,5.08 v43.81,10.79 | v40.32,36.2 40.32,38.73 40.01,39.05 R9.1
  Bottom 0.254: v43.81,10.79 43.81,24.77 40.32,28.26 v40.32,36.2
PWM1H  (via drill 0.3)
  Top 0.254: IC1.2 36.83,34.92 37.47,34.92 IC1.1 37.47,35.24 36.83,35.88 35.88,35.88 | IC1.4 35.56,35.56 35.88,35.88 | R18.3 18.1,40.96 18.1,42.23 JP2.2 LED6.C | v35.88,36.51 35.88,35.88
  Bottom 0.254: CON2.B25 CON2.A25 JP2.2 20.95,39.37 33.66,39.37 35.88,37.15 v35.88,36.51
PWM1L  (via drill 0.3)
  Top 0.254: JP2.1 15.56,42.23 | 15.56,42.23 16.83,40.96 17.14,40.96 R18.4 | IC1.5 34.92,35.56 v34.29,36.2 | 15.56,42.23 15.56,46.99 14.61,47.94 LED3.A
  Bottom 0.254: CON2.B26 CON2.A26 JP2.1 19.05,38.73 33.66,38.73 34.29,38.1 v34.29,36.2
PWM2H  (via drill 0.3)
  Top 0.254: IC1.12 36.2,30.16 35.88,30.48 | 35.88,30.48 34.92,30.48 34.61,30.16 | 34.61,30.16 34.29,29.84 IC1.9 | 34.61,30.16 34.92,29.84 IC1.10 | R18.1 19.68,40.96 20,40.96 JP2.4 LED7.C | v36.2,30.8 35.88,30.48
  Bottom 0.254: CON2.B23 CON2.A23 JP2.4 24.77,40.64 33.66,40.64 37.47,36.83 37.47,31.43 36.83,30.8 v36.2,30.8
PWM2L  (via drill 0.3)
  Top 0.254: 18.73,42.23 18.73,40.96 R18.2 | JP2.3 18.73,42.23 | v36.83,31.75 IC1.13 | 18.73,42.23 18.73,46.99 19.68,47.94 LED4.A
  Bottom 0.254: CON2.B24 CON2.A24 JP2.3 22.86,40.01 33.66,40.01 36.83,36.83 v36.83,31.75
PWM3H  (via drill 0.3)
  Top 0.254: IC2.2 43.18,34.92 43.81,34.92 IC2.1 43.81,35.24 43.18,35.88 42.23,35.88 | IC2.4 41.91,35.56 42.23,35.88 | R17.1 27.3,40.96 JP2.6 LED8.C | v42.23,36.2 42.23,35.88
  Bottom 0.254: CON2.B21 CON2.A21 JP2.6 28.57,41.91 33.66,41.91 37.94,37.62 40.8,37.62 v42.23,36.2
PWM3L  (via drill 0.3)
  Top 0.254: R17.4 24.77,40.96 JP2.5 23.81,44.13 23.81,46.99 24.77,47.94 LED5.A | v41.27,36.2 IC2.5
  Bottom 0.254: CON2.B22 CON2.A22 JP2.5 26.67,41.27 33.66,41.27 37.78,37.15 40.32,37.15 v41.27,36.2
SENS1  (via drill 0.3)
  Top 0.254: v16.51,13.65 20.32,17.46 21.59,17.46 IC5.14
  Bottom 0.254: 12.38,9.53 12.06,9.21 CON2.B2 | 12.38,9.53 v16.51,13.65 | JP5.1 1.91,37.78 1.27,37.15 1.27,20.64 12.38,9.53 | 12.38,9.53 CON2.B2 | CON2.B2 CON2.A2
SENS2  (via drill 0.3)
  Top 0.254: v22.86,16.83 21.91,16.83 IC5.15
  Bottom 0.254: 22.86,10.79 22.86,9.53 CON2.B6 CON2.A6 | 22.86,10.79 v22.86,16.83 | JP5.2 4.45,39.05 2.54,37.15 2.54,31.11 22.86,10.79
SENS3  (via drill 0.3)
  Top 0.254: v28.89,18.41 28.57,18.1 27.94,18.1 IC5.4
  Bottom 0.254: v28.89,18.41 26.35,15.88 26.35,13.65 28.89,11.11 28.89,6.67 28.26,6.03 26.67,6.03 24.77,4.13 | JP5.3 5.08,45.09 3.81,45.09 3.17,44.45 3.17,38.42 1.91,37.15 1.91,30.8 21.27,11.43 21.27,1.91 21.59,1.59 22.86,1.59 24.77,3.49 CON2.A7 24.77,4.13 | 24.77,4.13 CON2.B7
SHUNT_1
  Top 0.254: 26.04,27.94 20,27.94 R30.1 | T1.5 31.43,23.5 32.07,24.13 32.07,25.08 31.75,25.4 30.24,25.4 29.84,25.8 29.84,28.34 29.61,28.57 26.67,28.57 26.04,27.94 | 26.04,27.94 R1.2
SHUNT_2  (via drill 0.3)
  Top 0.254: 28.89,25.4 25.4,25.4 24.13,26.67 16.51,26.67 15.24,27.94 13.65,27.94 R32.1 | 28.89,25.4 28.57,25.72 28.57,26.04 28.57,27.62 R3.2 | v34.92,23.5 T2.5 | v29.21,20.32 29.21,25.08 28.89,25.4
  Bottom 0.254: v34.92,23.5 33.34,23.5 30.16,20.32 v29.21,20.32
SHUNT_SUM_H  (via drill 0.3)
  Top 0.254: 31.11,29.84 28.57,29.84 | R30.3 20,29.53 v20.95,29.53 26.04,29.53 26.04,29.84 | v14.61,29.53 13.65,29.53 R32.3 | v8.57,29.84 6.67,29.84 R33.1 | 26.04,29.84 28.57,29.84 | 28.57,29.84 R3.1 | 26.04,29.84 R1.1
  Top 0.508: R2.1 R53.1 | R53.1 31.11,29.84 | R53.1 30.9,29.84 28.57,29.84 | R3.1 28.36,29.84 26.04,29.84
  Bottom 0.254: v20.95,29.53 v14.61,29.53 14.29,29.84 v8.57,29.84
SHUNT_SUM_L
  Top 0.254: R33.3 6.67,31.43 8.89,31.43 9.21,31.75 27.62,31.75 28.57,32.7 R16.1 28.57,33.02
  Top 0.508: R2.2 30.9,34.29 30.48,34.29 29.21,33.02 28.57,33.02
V_M1  (via drill 0.3)
  Top 0.254: 32.38,14.92 32.07,14.61 C8.2 32.38,14.92 | 32.38,14.92 33.97,16.51 R11.8 | v16.83,14.92 20,18.1 21.59,18.1 IC5.13 | 32.38,14.92 v33.02,14.29
  Bottom 0.254: v16.83,14.92 20.64,11.11 20.64,1.91 21.59,0.95 29.84,0.95 31.43,2.54 31.43,12.7 v33.02,14.29
V_M2  (via drill 0.3)
  Top 0.254: 32.07,16.51 33.02,17.46 33.97,17.46 R11.7 | v29.21,16.19 27.94,16.19 IC5.1 | 32.07,16.51 v31.11,15.56 | 32.07,16.51 C9.2
  Bottom 0.254: v29.21,16.19 30.48,16.19 v31.11,15.56
V_M3  (via drill 0.3)
  Top 0.254: 32.07,18.41 32.38,18.1 33.97,18.1 R11.6 | v29.21,17.46 27.94,17.46 IC5.3 | 32.07,18.41 v31.11,17.46 | 32.07,18.41 C10.2
  Bottom 0.254: v31.11,17.46 v29.21,17.46
VREF  (via drill 0.3)
  Top 0.254: 18.1,34.61 18.1,35.24 R12.7 | v3.81,35.88 4.76,35.88 R13.6 | 9.21,33.66 v7.62,33.66 | 9.21,33.66 9.21,33.02 IC4.14 | 9.21,33.66 IC4.13 | 18.1,34.61 18.41,34.61 v20.64,32.38 | 18.1,34.61 R12.6
  Bottom 0.254: v3.81,35.88 5.4,35.88 6.67,34.61 | v7.62,33.66 6.67,34.61 | v20.64,32.38 20.64,30.8 21.59,29.84 21.59,29.21 21.27,28.89 7.94,28.89 7.62,28.57 6.99,28.57 6.67,28.89 6.67,34.61

### Text on the board
tPlace: PGM | SHLD | 3V3 | PWM1L | PWM1H | PWM2L | PWM2H | PWM3L | PWM3H | COM | SENS3 | SENS2 | SENS1 | GND | GND | 3 | 2 | 1 | HALL | + | X2C BLDC MOTOR / SHIELD REV.A
bPlace: http://x2c.microstickplus.com